# EAGLE schematic ECDL_CUR_CTRL (EAGLE 8.6.3)
CNAME: Alexander Impertro; CREVESION: 1.0

## Sheet 1 of 2
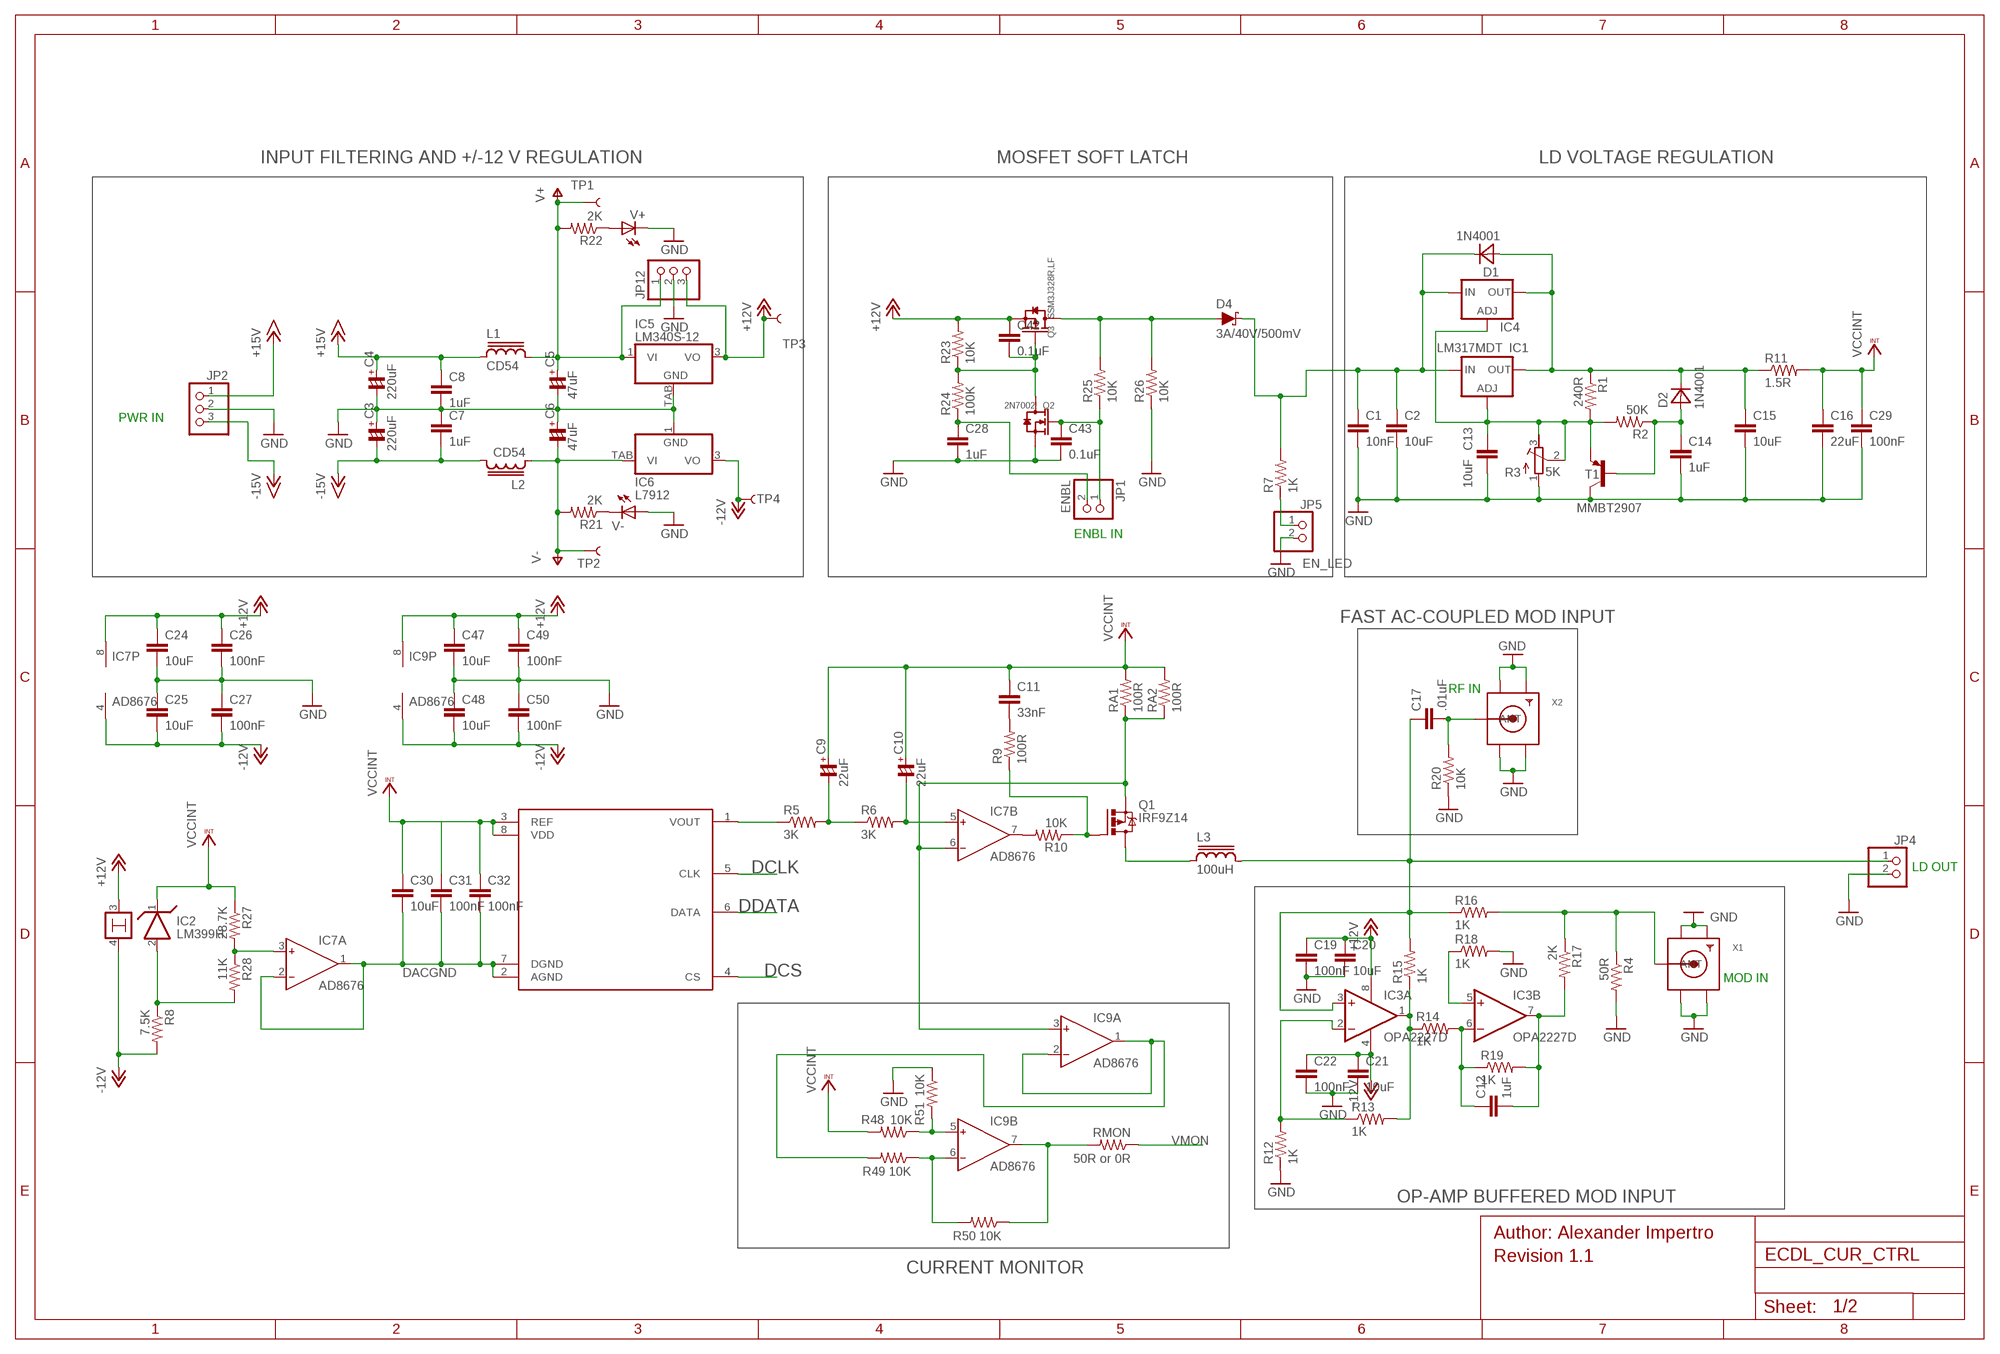
[diagram p0: schematic, sheet 1]

### Parts
C1  10nF  C-EUC0805  [C0805]
C2  10uF  C-EUC0805  [C0805]
C3  220uF  CP_SV-D  [CSV-D]
C4  220uF  CP_SV-D  [CSV-D]
C5  47uF  CP_3528-21R  [C3528-21R/T]
C6  47uF  CP_3528-21R  [C3528-21R/T]
C7  1uF  C-EUC0805  [C0805]
C8  1uF  C-EUC0805  [C0805]
C9  22uF  CP_SV-C  [CSV-C]
C10  22uF  CP_SV-C  [CSV-C]
C11  33nF  C-EUC0805  [C0805]
C12  1uF  C-EUC0805  [C0805]
C13  10uF  C-EUC0805  [C0805]
C14  1uF  C-EUC0805  [C0805]
C15  10uF  C-EUC0805  [C0805]
C16  22uF  C-EUC0805  [C0805]
C17  .01uF  C-EUC0805  [C0805]
C19  100nF  C-EUC0805  [C0805]
C20  10uF  C-EUC0805  [C0805]
C21  10uF  C-EUC0805  [C0805]
C22  100nF  C-EUC0805  [C0805]
C24  10uF  C-EUC0805  [C0805]
C25  10uF  C-EUC0805  [C0805]
C26  100nF  C-EUC0805  [C0805]
C27  100nF  C-EUC0805  [C0805]
C28  1uF  C-EUC0805  [C0805]
C29  100nF  C-EUC0805  [C0805]
C30  10uF  C-EUC0805  [C0805]
C31  100nF  C-EUC0805  [C0805]
C32  100nF  C-EUC0805  [C0805]
C42  0.1uF  C-EUC0805  [C0805]
C43  0.1uF  C-EUC0805  [C0805]
C47  10uF  C-EUC0805  [C0805]
C48  10uF  C-EUC0805  [C0805]
C49  100nF  C-EUC0805  [C0805]
C50  100nF  C-EUC0805  [C0805]
D1  1N4001  MBRA340T3  [SMA]
D2  1N4001  MBRA340T3  [SMA]
D4  3A/40V/500mV  DIODE-SCHOTTKY-B340A  [SMA-DIODE]
IC1  LM317MDT  [DPACK]
IC2  LM399H  [TO39/4]
IC3  OPA2227D  [SO08]
IC4  LM317TS  [317TS]
IC5  LM340S-12  [TO263-3]
IC6  L7912  [TO223-3]
IC7  AD8676  AD8656R  [SO8]
IC9  AD8676  AD8656R  [SO8]
JP1  ENBL  PINHD-1X2  [1X02]
JP2  PINHD-1X3/90  [1X03/90]
JP4  PINHD-1X2/90  [1X02/90]
JP5  EN_LED  PINHD-1X2  [1X02]
JP12  PINHD-1X3  [1X03]
L1  CD54  [CD54]
L2  CD54  [CD54]
L3  100uH  CD54  [CD54]
Q1  IRF9Z14  IRF9530  [TO220BV]
Q2  2N7002  SMD-MOSFET-N-CH-60V-300MA-LOGIC-LEVEL-FET-2N7002(SOT-23)  [SOT-23]
Q3  SSM3J328R,LF  SMD-MOSFET-P-CH-20V-6A-SSM3J328R(SOT-23)  [SOT-23]
R1  240R  R-US_R0805  [R0805]
R2  50K  R-US_R0805  [R0805]
R3  5K  R-TRIMM3296W  [RTRIM3296W]
R4  50R  R-US_R0805  [R0805]
R5  3K  R-US_R0805  [R0805]
R6  3K  R-US_R0805  [R0805]
R7  1K  R-US_R0805  [R0805]
R8  7.5K  R-US_R0805  [R0805]
R9  100R  R-US_R0805  [R0805]
R10  10K  R-US_R0805  [R0805]
R11  1.5R  R-US_R2512  [R2512]
R12  1K  R-US_R0805  [R0805]
R13  1K  R-US_R0805  [R0805]
R14  1K  R-US_R0805  [R0805]
R15  1K  R-US_R0805  [R0805]
R16  1K  R-US_R0805  [R0805]
R17  2K  R-US_R0805  [R0805]
R18  1K  R-US_R0805  [R0805]
R19  1K  R-US_R0805  [R0805]
R20  10K  R-US_R0805  [R0805]
R21  2K  R-US_R0805  [R0805]
R22  2K  R-US_R0805  [R0805]
R23  10K  R-US_R0805  [R0805]
R24  100K  R-US_R0805  [R0805]
R25  10K  R-US_R0805  [R0805]
R26  10K  R-US_R0805  [R0805]
R27  28.7K  R-US_R0805  [R0805]
R28  11K  R-US_R0805  [R0805]
R48  10K  R-US_R0805  [R0805]
R49  10K  R-US_R0805  [R0805]
R50  10K  R-US_R0805  [R0805]
R51  10K  R-US_R0805  [R0805]
RA1  100R  R-US_R2512  [R2512]
RA2  100R  R-US_R2512  [R2512]
RMON  50R or 0R  R-US_R0805  [R0805]
T1  MMBT2907  MMBT2907ALT1-PNP-SOT23-BEC  [SOT23-BEC]
TP1  TEST-POINT2  [PAD.02X.02]
TP2  TEST-POINT2  [PAD.02X.02]
TP3  TEST-POINT2  [PAD.02X.02]
TP4  TEST-POINT2  [PAD.02X.02]
U3  AD5541  [SOIC-8]
V+  LEDCHIPLED_0805  [CHIPLED_0805]
V-  LEDCHIPLED_0805  [CHIPLED_0805]
X1  SMACONNECTOR  [SMA90_DIP]
X2  SMACONNECTOR  [SMA90_DIP]

### Nets
+12V: C19.1 C20.1 C24.1 C26.1 C42.1 C47.1 C49.1 IC2.3 IC3.8(P:V+) IC5.3(VO) IC7.8(P:V+) IC9.8(P:V+) JP12.3 Q3.2(S) R23.2 TP3.P$1 ; also sheet 2
+15V: C4.+ C8.1 JP2.1 L1.1
-12V: C21.1 C22.1 C25.2 C27.2 C48.2 C50.2 IC2.4 IC3.4(P:V-) IC6.3(VO) IC7.4(P:V-) IC9.4(P:V-) R8.2 TP4.P$1 ; also sheet 2
-15V: C3.- C7.2 JP2.3 L2.2
DACGND: C30.2 C31.2 C32.2 IC7.1(A:OUT) IC7.2(A:IN-) U3.2(AGND) U3.7(DGND) ; also sheet 2
DCLK: U3.5(CLK) ; also sheet 2
DCS: U3.4(CS) ; also sheet 2
DDATA: U3.6(DATA) ; also sheet 2
GND: C1.2 C2.2 C3.+ C4.- C5.- C6.+ C7.1 C8.2 C13.2 C14.2 C15.2 C16.2 C19.2 C20.2 C21.2 C22.2 C24.2 C25.1 C26.2 C27.1 C28.2 C29.2 C43.2 C47.2 C48.1 C49.2 C50.1 IC5.TAB(GND) IC6.1(GND) JP2.2 JP4.2 JP5.2 JP12.2 Q2.2(S) R3.1(A) R4.2 R12.1 R18.2 R20.1 R26.1 R51.1 T1.C V+.C V-.A X1.GND1 X1.GND2 X1.GND3 X1.GND4 X2.GND1 X2.GND2 X2.GND3 X2.GND4 ; also sheet 2
N$1: C13.1 IC1.1(ADJ) IC4.1(ADJ) R1.2 R2.2 R3.2(S) R3.3(E) T1.E
N$2: L3.1 Q1.D
N$3: C14.1 D2.A R2.1 T1.B
N$4: C11.2 R9.2
N$5: R5.1 U3.1(VOUT)
N$6: C9.- R5.2 R6.1
N$7: C10.- IC7.5(B:IN+) R6.2
N$8: IC2.2 R8.1 R28.2
N$9: IC7.7(B:OUT) R10.2
N$11: Q1.G R9.1 R10.1
N$12: C43.1 JP1.1 Q2.1(G) R25.1
N$13: IC7.6(B:IN-) IC9.3(A:IN+) Q1.S RA1.1 RA2.1
N$14: C12.1 IC3.6(B:-IN) R14.2 R19.1
N$15: IC3.2(A:-IN) R12.2 R13.1
N$16: IC3.1(A:OUT) R13.2 R14.1 R15.1
N$17: C12.2 IC3.7(B:OUT) R17.2 R19.2
N$18: R4.1 R16.2 R17.1 X1.ANTENNA(ANT)
N$19: IC3.5(B:+IN) R18.1
N$20: C17.2 R20.2 X2.ANTENNA(ANT)
N$21: R22.1 V+.A
N$22: R21.1 V-.C
N$24: C1.1 C2.1 D1.C D4.C IC1.3(IN) IC4.3(IN) R7.2
N$26: C28.1 JP1.2 R24.1
N$27: C15.1 D1.A D2.C IC1.4(OUT) IC4.2(OUT) R1.1 R11.1
N$28: C42.2 Q2.3(D) Q3.1(G) R23.1 R24.2
N$29: IC7.3(A:IN+) R27.2 R28.1
N$30: D4.A Q3.3(D) R25.2 R26.2
N$35: C17.1 IC3.3(A:+IN) JP4.1 L3.2 R15.2 R16.1
N$37: JP5.1 R7.1
N$50: IC9.1(A:OUT) IC9.2(A:IN-) R49.2
N$51: IC9.5(B:IN+) R48.1 R51.2
N$52: IC9.6(B:IN-) R49.1 R50.2
N$54: IC9.7(B:OUT) R50.1 RMON.2
V+: C5.+ IC5.1(VI) JP12.1 L1.2 R22.2 TP1.P$1
V-: C6.- IC6.TAB(VI) L2.1 R21.2 TP2.P$1
VCCINT: C9.+ C10.+ C11.1 C16.1 C29.1 C30.1 C31.1 C32.1 IC2.1 R11.2 R27.1 R48.2 RA1.2 RA2.2 U3.3(REF) U3.8(VDD)
VMON: RMON.1 ; also sheet 2

### Notes on the sheet
- INPUT FILTERING AND +/-12 V REGULATION | MOSFET SOFT LATCH | LD VOLTAGE REGULATION
- PWR IN
- ENBL IN
- FAST AC-COUPLED MOD INPUT
- RF IN
- DCLK | LD OUT
- DDATA
- DACGND | DCS
- MOD IN
- VMON
- OP-AMP BUFFERED MOD INPUT
- Author: Alexander Impertro
- Revision 1.1
- CURRENT MONITOR

## Sheet 2 of 2
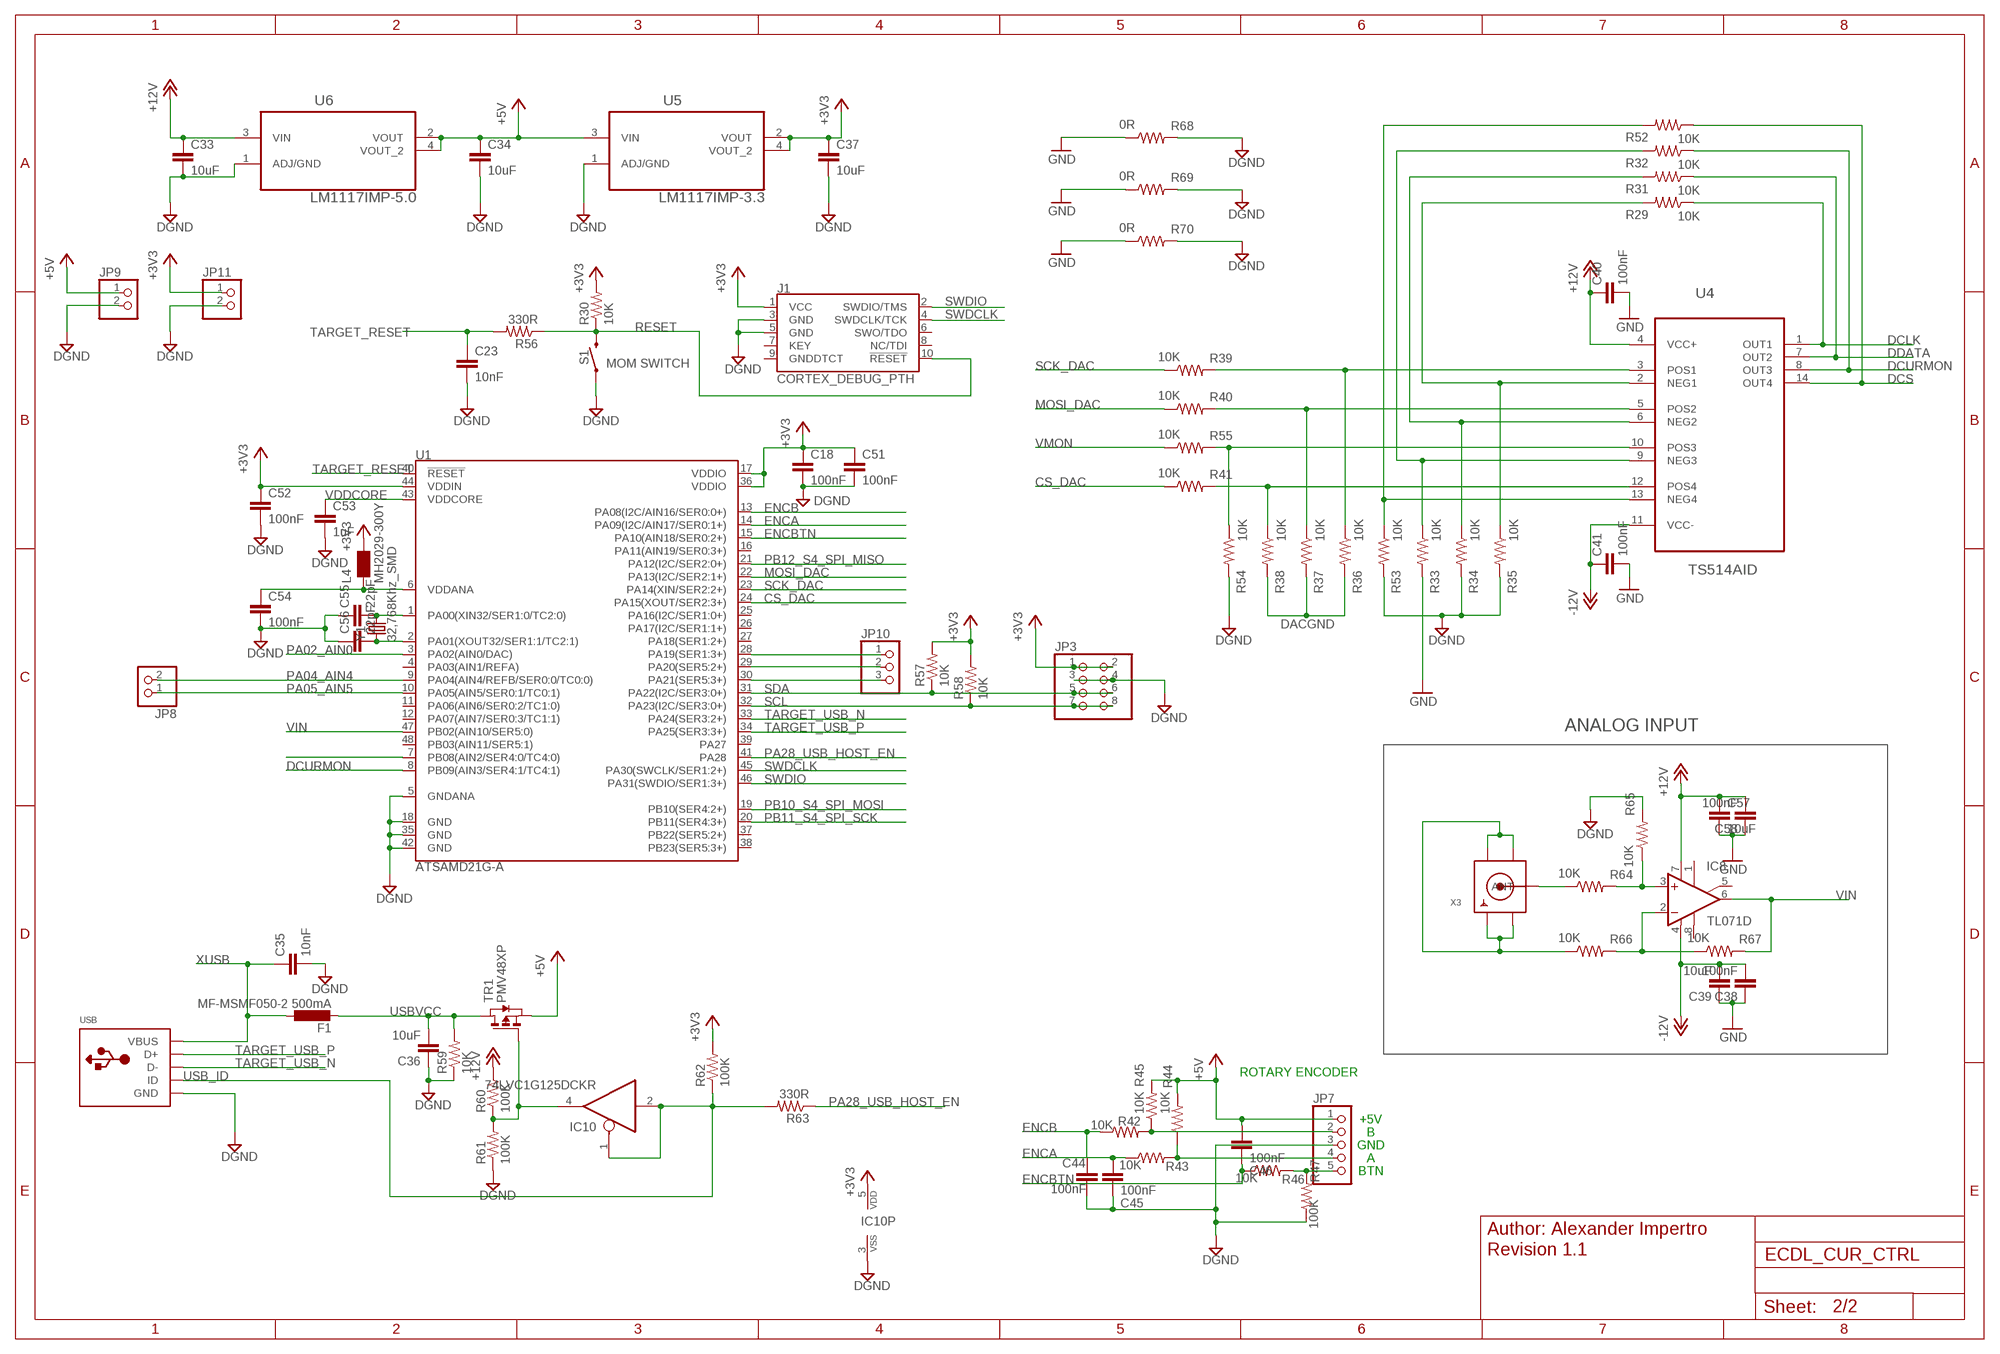
[diagram p1: schematic, sheet 2]

### Parts
C18  100nF  C-EUC0805  [C0805]
C23  10nF  C-EUC0805  [C0805]
C33  10uF  C-EUC0805  [C0805]
C34  10uF  C-EUC0805  [C0805]
C35  10nF  C-EUC0805  [C0805]
C36  10uF  C-EUC0805  [C0805]
C37  10uF  C-EUC0805  [C0805]
C38  100nF  C-EUC0805  [C0805]
C39  10uF  C-EUC0805  [C0805]
C40  100nF  C-EUC0805  [C0805]
C41  100nF  C-EUC0805  [C0805]
C44  100nF  C-EUC0805  [C0805]
C45  100nF  C-EUC0805  [C0805]
C46  100nF  C-EUC0805  [C0805]
C51  100nF  C-EUC0805  [C0805]
C52  100nF  C-EUC0805  [C0805]
C53  1uF  C-EUC0805  [C0805]
C54  100nF  C-EUC0805  [C0805]
C55  22pF  C-EUC0805  [C0805]
C56  22pF  C-EUC0805  [C0805]
C57  10uF  C-EUC0805  [C0805]
C58  100nF  C-EUC0805  [C0805]
F1  MF-MSMF050-2 500mA  PROTEZIONE_0002_MF-MSMF050-2  [PROTEZIONE_L1812]
IC8  TL071D  [SO08]
IC10  74LVC1G125DCKR  INTEGRATEDCIRCUITS_0040_SN74LVC1G125DCKR  [INTEGRATEDCIRCUITS_SC70-5]
J1  CORTEX_DEBUG_PTH  [2X5-PTH-1.27MM]
JP3  PINHD-2X4  [2X04]
JP7  PINHD-1X5  [1X05]
JP8  PINHD-1X2  [1X02]
JP9  PINHD-1X2  [1X02]
JP10  PINHD-1X3  [1X03]
JP11  PINHD-1X2  [1X02]
L4  MH2029-300Y  PROTEZIONE_0001_BLM21PG300SN1D_/_MH2029-300Y  [PROTEZIONE_0805]
R29  10K  R-US_R0805  [R0805]
R30  10K  R-US_R0805  [R0805]
R31  10K  R-US_R0805  [R0805]
R32  10K  R-US_R0805  [R0805]
R33  10K  R-US_R0805  [R0805]
R34  10K  R-US_R0805  [R0805]
R35  10K  R-US_R0805  [R0805]
R36  10K  R-US_R0805  [R0805]
R37  10K  R-US_R0805  [R0805]
R38  10K  R-US_R0805  [R0805]
R39  10K  R-US_R0805  [R0805]
R40  10K  R-US_R0805  [R0805]
R41  10K  R-US_R0805  [R0805]
R42  10K  R-US_R0805  [R0805]
R43  10K  R-US_R0805  [R0805]
R44  10K  R-US_R0805  [R0805]
R45  10K  R-US_R0805  [R0805]
R46  10K  R-US_R0805  [R0805]
R47  100K  R-US_R0805  [R0805]
R52  10K  R-US_R0805  [R0805]
R53  10K  R-US_R0805  [R0805]
R54  10K  R-US_R0805  [R0805]
R55  10K  R-US_R0805  [R0805]
R56  330R  R-US_R0805  [R0805]
R57  10K  R-US_R0805  [R0805]
R58  10K  R-US_R0805  [R0805]
R59  10K  R-US_R0805  [R0805]
R60  100K  R-US_R0805  [R0805]
R61  100K  R-US_R0805  [R0805]
R62  100K  R-US_R0805  [R0805]
R63  330R  R-US_R0805  [R0805]
R64  10K  R-US_R0805  [R0805]
R65  10K  R-US_R0805  [R0805]
R66  10K  R-US_R0805  [R0805]
R67  10K  R-US_R0805  [R0805]
R68  0R  R-US_R0805  [R0805]
R69  0R  R-US_R0805  [R0805]
R70  0R  R-US_R0805  [R0805]
S1  MOM SWITCH  MOMENTARY-SWITCH-SPST-SMD-5.2MM  [TACTILE_SWITCH_SMD_5.2MM]
TR1  PMV48XP  TRANSISTORS_0297_PMV48XP  [TRANSISTORS_SOT-23]
U1  ATSAMD21G-A  [TQFP-48]
U4  TS514AID  [SOIC127P600X175-14N]
U5  LM1117IMP-3.3  [SOT230P696X180-4N]
U6  LM1117IMP-5.0  [SOT230P696X180-4N]
USB  USBMINIB  [USB-MINIB]
X3  SMACONNECTOR  [SMA90_DIP]
Y1  32,768Khz_SMD  CRISTALLI_0213_ABS07-32.768KHZ-T  [CRISTALLI_RESONATOR_EPSON_FC_145]

### Nets
+3V3: C18.1 C37.1 C51.1 C52.1 IC10.5(VDD) J1.1(VCC) JP3.1 JP3.2 JP11.1 L4.2 R30.2 R57.2 R58.2 R62.2 U1.17(VDDIO) U1.36(VDDIO) U1.44(VDDIN) U5.2(VOUT) U5.4(VOUT_2)
+5V: C34.1 C46.1 JP7.1 JP9.1 R44.2 R45.2 TR1.2(S) U5.3(VIN) U6.2(VOUT) U6.4(VOUT_2)
+12V: C33.1 C40.1 C57.1 C58.2 IC8.7(V+) R60.2 U4.4(VCC+) U6.3(VIN) ; also sheet 1
-12V: C38.2 C39.2 C41.1 IC8.4(V-) U4.11(VCC-) ; also sheet 1
CS_DAC: R41.1 U1.24(PA15(XOUT/SER2:3+))
DACGND: R36.2 R37.2 R38.2 ; also sheet 1
DCLK: R29.1 U4.1(OUT1) ; also sheet 1
DCS: R52.1 U4.14(OUT4) ; also sheet 1
DCURMON: R32.1 U1.8(PB09(AIN3/SER4:1/TC4:1)) U4.8(OUT3)
DDATA: R31.1 U4.7(OUT2) ; also sheet 1
DGND: C18.2 C23.2 C33.2 C34.2 C35.2 C36.1 C37.2 C44.2 C45.2 C51.2 C52.2 C53.2 C54.2 C55.1 C56.1 IC10.3(VSS) J1.3(GND) J1.5(GND) JP3.3 JP3.4 JP7.3 JP9.2 JP11.2 R34.2 R35.2 R47.1 R53.2 R54.2 R59.1 R61.1 R65.2 R68.2 R69.2 R70.2 S1.1 U1.5(GNDANA) U1.18(GND) U1.35(GND) U1.42(GND) U5.1(ADJ/GND) U6.1(ADJ/GND) USB.GND
ENCA: C45.1 R43.1 U1.14(PA09(I2C/AIN17/SER0:1+))
ENCB: C44.1 R42.1 U1.13(PA08(I2C/AIN16/SER0:0+))
ENCBTN: C46.2 R46.1 U1.15(PA10(AIN18/SER0:2+))
GND: C38.1 C39.1 C40.2 C41.2 C57.2 C58.1 R33.2 R68.1 R69.1 R70.1 ; also sheet 1
MOSI_DAC: R40.1 U1.22(PA13(I2C/SER2:1+))
N$10: R29.2 R35.1 U4.2(NEG1)
N$23: R36.1 R39.2 U4.3(POS1)
N$25: C54.1 L4.1 U1.6(VDDANA)
N$31: U1.7(PB08(AIN2/SER4:0/TC4:0))
N$32: R31.2 R34.1 U4.6(NEG2)
N$33: R66.1 X3.GND1 X3.GND2 X3.GND3 X3.GND4
N$34: R64.1 X3.ANTENNA(ANT)
N$36: JP7.2 R42.2 R45.1
N$38: IC8.3(+IN) R64.2 R65.1
N$39: R32.2 R33.1 U4.9(NEG3)
N$40: JP7.4 R43.2 R44.1
N$41: R37.1 R40.2 U4.5(POS2)
N$42: R38.1 R41.2 U4.12(POS4)
N$43: JP7.5 R46.2 R47.2
N$44: C55.2 U1.1(PA00(XIN32/SER1:0/TC2:0)) Y1.P$2
N$45: C56.2 U1.2(PA01(XOUT32/SER1:1/TC2:1)) Y1.P$1
N$46: IC10.4(O) R60.1 R61.2 TR1.3(G)
N$47: IC8.2(-IN) R66.2 R67.1
N$48: JP10.3 U1.30(PA21(SER5:3+))
N$49: JP10.2 U1.29(PA20(SER5:2+))
N$53: JP10.1 U1.28(PA19(SER1:3+))
N$55: R54.1 R55.2 U4.10(POS3)
N$56: R52.2 R53.1 U4.13(NEG4)
PA02_AIN0: U1.3(PA02(AIN0/DAC))
PA04_AIN4: JP8.2 U1.9(PA04(AIN4/REFB/SER0:0/TC0:0))
PA05_AIN5: JP8.1 U1.10(PA05(AIN5/SER0:1/TC0:1))
PA28_USB_HOST_EN: R63.1 U1.41(PA28)
PB10_S4_SPI_MOSI: U1.19(PB10(SER4:2+))
PB11_S4_SPI_SCK: U1.20(PB11(SER4:3+))
PB12_S4_SPI_MISO: U1.21(PA12(I2C/SER2:0+))
RESET: J1.10(!RESET) R30.1 R56.1 S1.3
SCK_DAC: R39.1 U1.23(PA14(XIN/SER2:2+))
SCL: JP3.7 JP3.8 R58.1 U1.32(PA23(I2C/SER3:0+))
SDA: JP3.5 JP3.6 R57.1 U1.31(PA22(I2C/SER3:0+))
SWDCLK: J1.4(SWDCLK/TCK) U1.45(PA30(SWCLK/SER1:2+))
SWDIO: J1.2(SWDIO/TMS) U1.46(PA31(SWDIO/SER1:3+))
TARGET_RESET: C23.1 R56.2 U1.40(!RESET!)
TARGET_USB_N: U1.33(PA24(SER3:2+)) USB.D-
TARGET_USB_P: U1.34(PA25(SER3:3+)) USB.D+
USB_ID: IC10.1(OE) IC10.2(I) R62.1 R63.2 USB.ID
USBVCC: C36.2 F1.2 R59.2 TR1.1(D)
VDDCORE: C53.1 U1.43(VDDCORE)
VIN: IC8.6(OUT) R67.2 U1.47(PB02(AIN10/SER5:0))
VMON: R55.1 ; also sheet 1
XUSB: C35.1 F1.1 USB.VBUS
Unconnected: IC8.1(ON1) IC8.5(ON2) IC8.8(OPT) J1.6(SWO/TDO) J1.7(KEY) J1.8(NC/TDI) J1.9(GNDDTCT) U1.4(PA03(AIN1/REFA)) U1.11(PA06(AIN6/SER0:2/TC1:0)) U1.12(PA07(AIN7/SER0:3/TC1:1)) U1.16(PA11(AIN19/SER0:3+)) U1.25(PA16(I2C/SER1:0+)) U1.26(PA17(I2C/SER1:1+)) U1.27(PA18(SER1:2+)) U1.37(PB22(SER5:2+)) U1.38(PB23(SER5:3+)) U1.39(PA27) U1.48(PB03(AIN11/SER5:1))

### Notes on the sheet
- DCLK
- DDATA
- DCURMON
- DCS
- DACGND
- ANALOG INPUT
- ROTARY ENCODER
- +5V
- B
- GND
- A
- BTN
- Author: Alexander Impertro
- Revision 1.1

## Library data of the parts
C1 C2 C7 C8 C11-C58 = rcl:C-EU: CAPACITOR, European symbol; SPICEPREFIX: C
C3 C4 C9 C10 = rc-master-smd:CP_: POLARIZED CAP
C5 C6 = rc-master:CP_: POLARIZED CAP
D1 D2 = diode:MBRA340T3: Surface Mount Schottky Power Rectifier Source: http://www.onsemi.com/pub_link/Collateral/MBRA340T3-D.PDF
D4 = SparkFun-DiscreteSemi:DIODE-SCHOTTKY: Schottky diode A Schottky diode is a semiconductor diode which has a low forward voltage drop and a very fast switching action.; PROD_ID: DIO-09886
F1 = Arduino-M0-V1:PROTEZIONE_0002_MF-MSMF050-2: 500 mA Multifuse ? Polyfuse; MONTHLY_USAGE: _____; PART_NUMBER: MF-MSMF050-2; PRICE: _____; SUPPLIER: _____; TYPE: Protezione
IC1 = v-reg:LM317?*: 500 mA Adjustable Output Positive Voltage Regulator Source: http://www.onsemi.co.jp .. LM317M-D.PDF
IC2 = linear:LM399H: Precision Z DIODE
IC3 = linear:OPA222*: High Precision, Low Noise OPERATIONAL AMPLIFIERS Source: http://focus.ti.com/lit/ds/symlink/opa227.pdf
IC4 = v-reg:LM317TS: VOLTAGE REGULATOR
IC5 = linear:LM340?-*: Positive VOLTAGE REGULATOR Source: http://cache.national.com/ds/LM/LM340.pdf
IC6 = misc-ics:L7912
IC7 IC9 = analog-devices:AD8656: Low Noise, Precision CMOS Amplifier Source: http://www.analog.com/static/imported-files/data_sheets/AD8655_8656.pdf; MPN: AD8656ARZ; OC_FARNELL: 1117887; OC_NEWARK: 19M0993
IC8 = linear:TL071: OP AMP
IC10 = Arduino-M0-V1:INTEGRATEDCIRCUITS_0040_SN74LVC1G125DCKR: Single bus buffer with 3-state output; CASE: SC70; MONTHLY_USAGE: _____; PART_NUMBER: SN74LVC1G125DCKR; PRICE: _____; SUPPLIER: _____; TYPE: Circuito_Integrato
J1 = SparkFun-Connectors:CORTEX_DEBUG: Cortex Debug Connector - 10 pin Supports JTAG debug, Serial Wire debug, and Serial Wire Viewer. PTH and SMD connector options available. General Connector Information <http://infocenter.arm.com/help/topic/com.arm.doc.faqs/attached/13634/cortex_debug_connectors.pdf> Products: PTH Connector <http://www.digikey.com/product-detail/en/cnc-tech/3220-10-0100-00/1175-1627-ND/3883661> -via Digi-Key SparkFun PSoc <https://www.sparkfun.com/products/13229> SparkFun T <https://www.sparkfun.com/products/13810>
JP1 JP4 JP5 JP8 JP9 JP11 = pinhead:PINHD-1X2: PIN HEADER
JP2 JP10 JP12 = pinhead:PINHD-1X3: PIN HEADER
JP3 = pinhead:PINHD-2X4: PIN HEADER
JP7 = pinhead:PINHD-1X5: PIN HEADER
L1-L3 = inductor-sumida:CD54: POWER INDUCTOR
L4 = Arduino-M0-V1:PROTEZIONE_0001_BLM21PG300SN1D_/_MH2029-300Y: BLM21; MONTHLY_USAGE: _____; PART_NUMBER: BLM21PG300SN1D_/_MH2029-300Y; PRICE: _____; SUPPLIER: _____; TYPE: Protezione
Q1 = transistor-power:IRF9530: P-CHANNEL HEXFET POWER-MOS-FET Source: http://www.irf.com/product-info/datasheets/data/irf9530.pdf
Q2 = Seeed-Transistor:SMD-MOSFET-N-CH-60V-300MA-LOGIC-LEVEL-FET-2N7002(SOT-23): 305030028; MPN: 2N7002,215
Q3 = Seeed-Transistor:SMD-MOSFET-P-CH-20V-6A-SSM3J328R(SOT-23): 305030075; MPN: SSM3J328R,LF
R1 R2 R4-R10 R12-R70 RMON = rcl:R-US_: RESISTOR, American symbol; SPICEPREFIX: R
R3 = rcl:R-TRIMM: Trimm resistor
R11 RA1 RA2 = adafruit:R-US_: RESISTOR, American symbol
S1 = SparkFun-Switches:MOMENTARY-SWITCH-SPST: Momentary Switch (Pushbutton) - SPST Normally-open (NO) SPST momentary switches (buttons, pushbuttons). Variants PTH-12MM - 12mm square, through-hole Momentary Pushbutton Switch - 12mm Square <https://www.sparkfun.com/products/9190> (COM-09190) PTH-6.0MM, PTH-6.0MM-KIT - 6.0mm square, through-hole Mini Pushbutton Switch <https://www.sparkfun.com/products/97> (COM-00097) KIT package intended for soldering kit's - only one side of pads' copper is exposed. PTH-RIGHT-ANGLE-KIT - Right-angle, through-hole Right Angle Tactile Button <https://www.sparkfun.com/products/10791> - Used on SparkFun BigTime Watch Kit <https://www.sparkfun.com/products/11734> SMD-12MM - 12mm square, surface-mount Tactile Button - SMD (12mm) <https://www.sparkfun.com/products/12993> (COM-12993) Used on SparkFun PicoBoard <https://www.sparkfun.com/products/11888> SMD-4.5MM - 4.5mm Square Trackball Switch Used on SparkFun Blackberry Trackballer Breakout <https://www.sparkfun.com/products/13169> SMD-4.6MMX2.8MM - 4.60mm x 2.80mm, surface mount Used on SparkFun SAMD21 Mini Breakout <https://www.sparkfun.com/products/13664> SMD-5.2MM, SMD-5.2-REDUNDANT - 5.2mm square, surface-mount Mini Pushbutton Switch - SMD <https://www.sparkfun.com/products/8720> (COM-08720) Used on Arduino Pro Mini <https://www.sparkfun.com/products/11114> REDUNDANT package connects both switch circuits together SMD-6.0X3.5MM - 6.0 x 3.5mm, surface mount Momentary Reset Switch SMD <https://www.sparkfun.com/products/8229> (COM-08229) SMD-6.2MM-TALL - 6.2mm square, surface mount Tactile Button - SMD (6mm) <https://www.sparkfun.com/products/12992> Used on SparkFun Digital Sandbox <https://www.sparkfun.com/products/12651> SMD-RIGHT-ANGLE - Right-angle, surface mount Used on SparkFun Block for Intel® Edison - Arduino <https://www.sparkfun.com/products/13036>; PROD_ID: SWCH-08247; SF_SKU: COM-08720
T1 = transistor-neu-to92:*-PNP-: PNP Transistror
TP1-TP4 = SparkFun-Connectors:TEST-POINT: SparkFun Test Points Bare copper test points for troubleshooting or In-Circuit-Testing. These are used by our Production team for verifying production board runs using pogo-pins on test beds. SparkFun Products: SparkFun LSM9DS1 Breakout <https://www.sparkfun.com/products/13284> SparkFun PSOC <https://www.sparkfun.com/products/13714> SparkFun Load Cell Amplifier <https://www.sparkfun.com/products/13879>
TR1 = Arduino-M0-V1:TRANSISTORS_0297_PMV48XP: 20 V, 3.5 A P-channel Trench MOSFET - PMV48XP; CASE: SOT23; MONTHLY_USAGE: _____; PART_NUMBER: PMV48XP; PRICE: _____; SUPPLIER: _____; TYPE: Transistor
U1 = SparkFun-IC-Microcontroller:ATSAMD21G: Atmel SAMD21G SMART ARM-Based Microcontroller The Atmel ® | SMART ™ SAM D21 is a series of low-power microcontrollers using the 32-bit ARM ® Cortex ® -M0+ processor, and ranging from 32- to 64-pins with up to 256KB Flash and 32KB of SRAM. The SAM D21 devices operate at a maximum frequency of 48MHz and reach 2.46 CoreMark/MHz. They are designed for simple and intuitive migration with identical peripheral modules, hex compatible code, identical linear address map and pin compatible migration paths between all devices in the product series. All devices include intelligent and flexible peripherals, Atmel Event System for inter-peripheral signaling, and support for capacitive touch button, slider and wheel user interfaces. Datasheet <https://cdn.sparkfun.com/datasheets/Dev/Arduino/Boards/Atmel-42181-SAM-D21_Datasheet.pdf> SparkFun Products SparkFun SAMD21 Mini Breakout <https://www.sparkfun.com/products/13664> (DEV-13664) SparkFun SAMD21 Dev Breakout <https://www.sparkfun.com/products/13672> (DEV-13672); PROD_ID: IC-13064
U3 = misc-ics:AD5541
U4 = ST Microelctronics_By_element14_Batch_1:TS514AID: Precision quad operational amplifier; MPN: TS514AID; OC_FARNELL: 1737199; OC_NEWARK: 26R7235; PACKAGE: 14-SOIC; SUPPLIER: STMICROELECTRONICS
U5 = NSC_By_element14_Batch_1.1:LM1117IMP-3.3: IC REG LDO 800MA 3.3V; MPN: LM1117IMP-3.3; OC_FARNELL: 1469051; OC_NEWARK: 41K3450; PACKAGE: SOT-223; SUPPLIER: National Semiconductor
U6 = NSC_By_element14_Batch_1.1:LM1117IMP-5.0: IC REG LDO 800MA 5.0V; MPN: LM1117IMP-5.0; OC_FARNELL: -; OC_NEWARK: 41K3451; PACKAGE: SOT-223; SUPPLIER: National Semiconductor
USB = adafruit:USB: USB Connectors USBMINIB - Surface Mount Female Mini-B USB Connector 4UConnector: 06564 By microbuilder.eu Thru-hole RA Female Mini-B USB Connector 4UConnector: 18732 By ladyada.net
V+ V- = led:LED: LED OSRAM: - CHIPLED LG R971, LG N971, LY N971, LG Q971, LY Q971, LO R971, LY R971 LH N974, LH R974 LS Q976, LO Q976, LY Q976 LO Q996 - Hyper CHIPLED LW Q18S LB Q993, LB Q99A, LB R99A - SideLED LS A670, LO A670, LY A670, LG A670, LP A670 LB A673, LV A673, LT A673, LW A673 LH A674 LY A675 LS A676, LA A676, LO A676, LY A676, LW A676 LS A679, LY A679, LG A679 - Hyper Micro SIDELED® LS Y876, LA Y876, LO Y876, LY Y876 LT Y87S - SmartLED LW L88C, LW L88S LB L89C, LB L89S, LG L890 LS L89K, LO L89K, LY L89K LS L896, LA L896, LO L896, LY L896 - TOPLED LS T670, LO T670, LY T670, LG T670, LP T670 LSG T670, LSP T670, LSY T670, LOP T670, LYG T670 LG T671, LOG T671, LSG T671 LB T673, LV T673, LT T673, LW T673 LH T674 LS T676, LA T676, LO T676, LY T676, LB T676, LH T676, LSB T676, LW T676 LB T67C, LV T67C, LT T67C, LS T67K, LO T67K, LY T67K, LW E67C LS E67B, LA E67B, LO E67B, LY E67B, LB E67C, LV E67C, LT E67C LW T67C LS T679, LY T679, LG T679 LS T770, LO T770, LY T770, LG T770, LP T770 LB T773, LV T773, LT T773, LW T773 LH T774 LS E675, LA E675, LY E675, LS T675 LS T776, LA T776, LO T776, LY T776, LB T776 LHGB T686 LT T68C, LB T68C - Hyper Mini TOPLED® LB M676 - Mini TOPLED Santana® LG M470 LS M47K, LO M47K, LY M47K Source: http://www.osram.convergy.de LUXEON: - LUMILED® LXK2-PW12-R00, LXK2-PW12-S00, LXK2-PW14-U00, LXK2-PW14-V00 LXK2-PM12-R00, LXK2-PM12-S00, LXK2-PM14-U00 LXK2-PE12-Q00, LXK2-PE12-R00, LXK2-PE12-S00, LXK2-PE14-T00, LXK2-PE14-U00 LXK2-PB12-K00, LXK2-PB12-L00, LXK2-PB12-M00, LXK2-PB14-N00, LXK2-PB14-P00, LXK2-PB14-Q00 LXK2-PR12-L00, LXK2-PR12-M00, LXK2-PR14-Q00, LXK2-PR14-R00 LXK2-PD12-Q00, LXK2-PD12-R00, LXK2-PD12-S00 LXK2-PH12-R00, LXK2-PH12-S00 LXK2-PL12-P00, LXK2-PL12-Q00, LXK2-PL12-R00 Source: www.luxeon.com KINGBRIGHT: KA-3528ASYC Source: www.kingbright.com
X1-X3 = adafruit:SMACONNECTOR: SMA Connector 90° DIP SMA Connector, 50 Ohm (4UConnector: 07259)
Y1 = Arduino-M0-V1:CRISTALLI_0213_ABS07-32.768KHZ-T: 32,768KHz - SMD; MONTHLY_USAGE: _____; PART_NUMBER: ABS07-32.768KHZ-T; PRICE: _____; SUPPLIER: _____; TYPE: Cristalli